# EAGLE design axm1 (EAGLE 5.07)
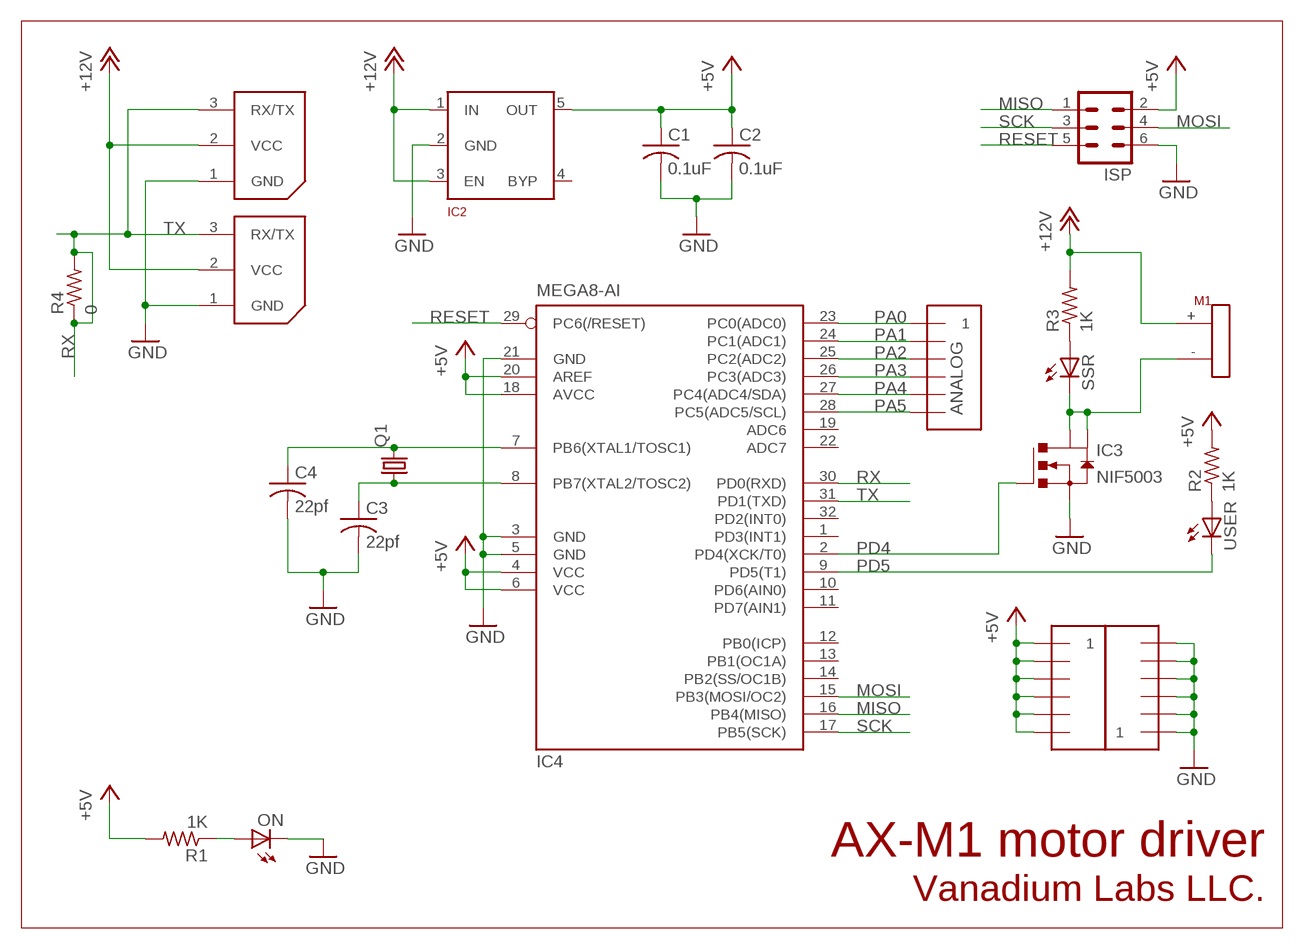
[diagram p0: schematic, sheet 1]

## Parts
C1  0.1uF  C-USC0603  [C0603]
C2  0.1uF  C-USC0603  [C0603]
C3  22pf  C-USC0603  [C0603]
C4  22pf  C-USC0603  [C0603]
IC2  MIC5205-5.0  MIC5205-3.3  [SOT-23-5]
IC3  NIF5003  [SOT223]
IC4  MEGA8-AI  [TQFP32-08]
ISP  MA03-2  [MA03-2]
M1  POWER  [POWER]
ON  LEDCHIPLED_0603  [CHIPLED_0603]
Q1  CRYSTALHC49S  [HC49/S]
R1  1K  R-US_R0603  [R0603]
R2  1K  R-US_R0603  [R0603]
R3  1K  R-US_R0603  [R0603]
R4  0  R-US_R0603  [R0603]
SSR  LEDCHIPLED_0603  [CHIPLED_0603]
U$1  AX-12  [WM18887-ND]
U$2  HEADER6  [1X6]
U$3  HEADER2X6  [2X6]
U$5  AX-12  [WM18887-ND]
USER  LEDCHIPLED_0603  [CHIPLED_0603]

## Nets
+5V: C1.1 C2.1 IC2.5(OUT) IC4.4(VCC) IC4.6(VCC) IC4.18(AVCC) IC4.20(AREF) ISP.2 R1.2 R2.2 U$3.P$7 U$3.P$8 U$3.P$9 U$3.P$10 U$3.P$11 U$3.P$12
+12V: IC2.1(IN) IC2.3(EN) M1.+ R3.2 U$1.2(VCC) U$5.2(VCC)
GND: C1.2 C2.2 C3.2 C4.2 IC2.2(GND) IC3.3(SOURCE) IC4.3(GND) IC4.5(GND) IC4.21(GND) ISP.6 ON.C U$1.1(GND) U$3.P$1 U$3.P$2 U$3.P$3 U$3.P$4 U$3.P$5 U$3.P$6 U$5.1(GND)
MISO: IC4.16(PB4(MISO)) ISP.1
MOSI: IC4.15(PB3(MOSI/OC2)) ISP.4
N$4: IC3.2(DRAIN) IC3.4(DRAIN2) M1.- SSR.C
N$7: R3.1 SSR.A
N$9: C4.1 IC4.7(PB6(XTAL1/TOSC1)) Q1.2
N$10: C3.1 IC4.8(PB7(XTAL2/TOSC2)) Q1.1
N$13: ON.A R1.1
N$14: R2.1 USER.A
PA0: IC4.23(PC0(ADC0)) U$2.P$1
PA1: IC4.24(PC1(ADC1)) U$2.P$2
PA2: IC4.25(PC2(ADC2)) U$2.P$3
PA3: IC4.26(PC3(ADC3)) U$2.P$4
PA4: IC4.27(PC4(ADC4/SDA)) U$2.P$5
PA5: IC4.28(PC5(ADC5/SCL)) U$2.P$6
PD4: IC3.1(GATE) IC4.2(PD4(XCK/T0))
PD5: IC4.9(PD5(T1)) USER.C
RESET: IC4.29(PC6(/RESET)) ISP.5
SCK: IC4.17(PB5(SCK)) ISP.3
TX: IC4.30(PD0(RXD)) IC4.31(PD1(TXD)) R4.1 R4.2 U$1.3(RX/TX) U$5.3(RX/TX)
Unconnected: IC2.4(BYP) IC4.1(PD3(INT1)) IC4.10(PD6(AIN0)) IC4.11(PD7(AIN1)) IC4.12(PB0(ICP)) IC4.13(PB1(OC1A)) IC4.14(PB2(SS/OC1B)) IC4.19(ADC6) IC4.22(ADC7) IC4.32(PD2(INT0))

## Notes on the sheet
- TX
- ANALOG
- RX
- RX
- AX-M1 motor driver
- Vanadium Labs LLC.

## Library data of the parts
C1-C4 = rcl:C-US: CAPACITOR, American symbol
IC2 = robots:MIC5205-3.3
IC3 = robots:NIF5003
IC4 = atmel:MEGA8: MICROCONTROLLER 8 Kbytes FLASH, 1 kbytes SRAM, 512 bytes EEPROM, USART, 6-channel 10 bit ADC, 2-channel 8 bit ADC Pin compatible with Atmega48, ATMega88, ATMega168 Source: avr.lbr
ISP = con-lstb:MA03-2: PIN HEADER
M1 = robots:POWER
ON SSR USER = led:LED: LED OSRAM: - CHIPLED LG R971, LG N971, LY N971, LG Q971, LY Q971, LO R971, LY R971 LH N974, LH R974 LS Q976, LO Q976, LY Q976 LO Q996 - Hyper CHIPLED LW Q18S LB Q993, LB Q99A, LB R99A - SideLED LS A670, LO A670, LY A670, LG A670, LP A670 LB A673, LV A673, LT A673, LW A673 LH A674 LY A675 LS A676, LA A676, LO A676, LY A676, LW A676 LS A679, LY A679, LG A679 - Hyper Micro SIDELED® LS Y876, LA Y876, LO Y876, LY Y876 LT Y87S - SmartLED LW L88C, LW L88S LB L89C, LB L89S, LG L890 LS L89K, LO L89K, LY L89K LS L896, LA L896, LO L896, LY L896 - TOPLED LS T670, LO T670, LY T670, LG T670, LP T670 LSG T670, LSP T670, LSY T670, LOP T670, LYG T670 LG T671, LOG T671, LSG T671 LB T673, LV T673, LT T673, LW T673 LH T674 LS T676, LA T676, LO T676, LY T676, LB T676, LH T676, LSB T676, LW T676 LB T67C, LV T67C, LT T67C, LS T67K, LO T67K, LY T67K, LW E67C LS E67B, LA E67B, LO E67B, LY E67B, LB E67C, LV E67C, LT E67C LW T67C LS T679, LY T679, LG T679 LS T770, LO T770, LY T770, LG T770, LP T770 LB T773, LV T773, LT T773, LW T773 LH T774 LS E675, LA E675, LY E675, LS T675 LS T776, LA T776, LO T776, LY T776, LB T776 LHGB T686 LT T68C, LB T68C - Hyper Mini TOPLED® LB M676 - Mini TOPLED Santana® LG M470 LS M47K, LO M47K, LY M47K Source: http://www.osram.convergy.de LUXEON: - LUMILED® LXK2-PW12-R00, LXK2-PW12-S00, LXK2-PW14-U00, LXK2-PW14-V00 LXK2-PM12-R00, LXK2-PM12-S00, LXK2-PM14-U00 LXK2-PE12-Q00, LXK2-PE12-R00, LXK2-PE12-S00, LXK2-PE14-T00, LXK2-PE14-U00 LXK2-PB12-K00, LXK2-PB12-L00, LXK2-PB12-M00, LXK2-PB14-N00, LXK2-PB14-P00, LXK2-PB14-Q00 LXK2-PR12-L00, LXK2-PR12-M00, LXK2-PR14-Q00, LXK2-PR14-R00 LXK2-PD12-Q00, LXK2-PD12-R00, LXK2-PD12-S00 LXK2-PH12-R00, LXK2-PH12-S00 LXK2-PL12-P00, LXK2-PL12-Q00, LXK2-PL12-R00 Source: www.luxeon.com KINGBRIGHT: KA-3528ASYC Source: www.kingbright.com
Q1 = crystal:CRYSTAL: CRYSTAL
R1-R4 = rcl:R-US_: RESISTOR, American symbol
U$1 U$5 = robots:AX-12
U$2 = robots:HEADER6
U$3 = robots:HEADER2X6

## Board
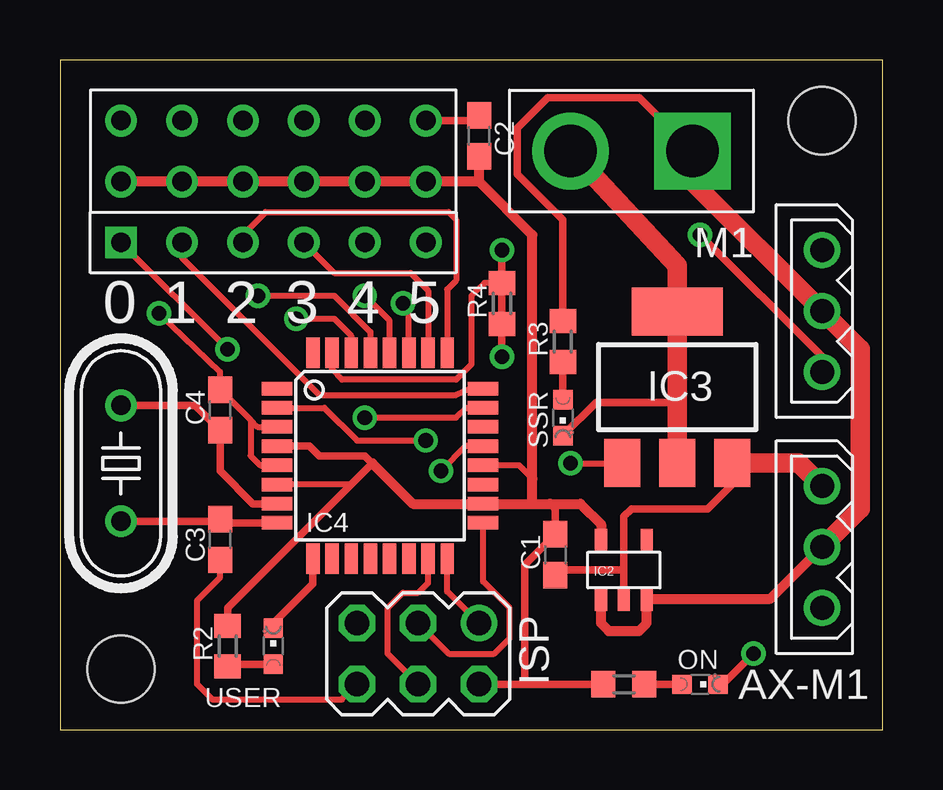
[diagram p1: board, top side]
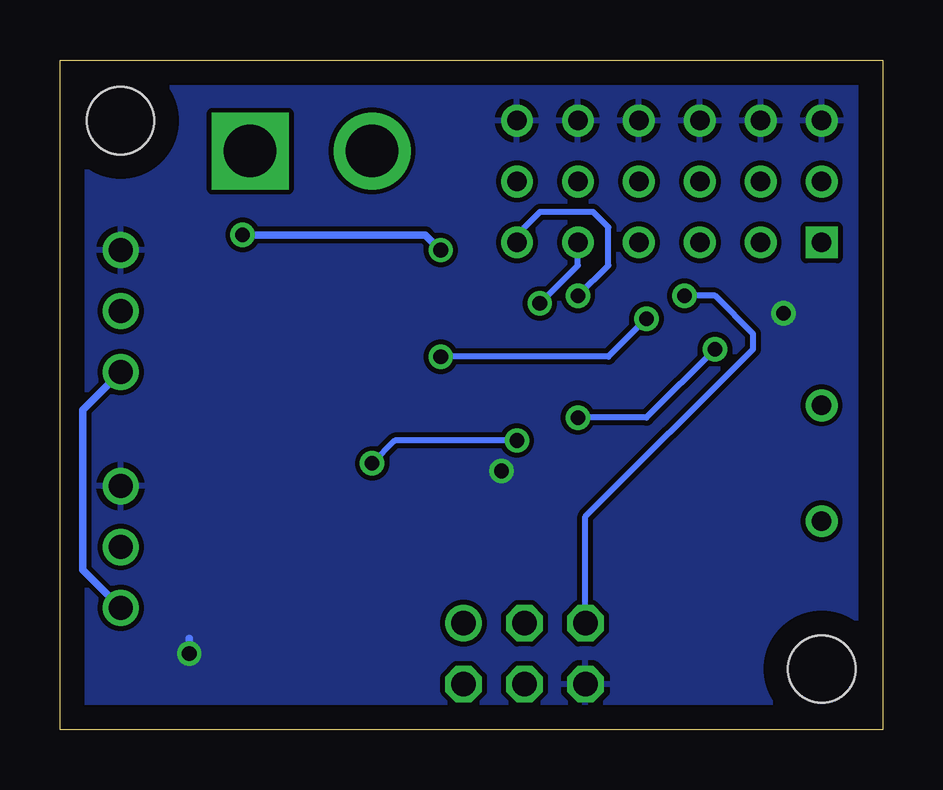
[diagram p2: board, bottom side, seen from below]

Size 34.28 x 27.93 mm. Coordinates in mm from the lower left corner, seen from the top.
Outline: 0,0 34.28,0 34.28,27.93 0,27.93 0,0
Copper layers (1*16): Top 0.035mm / dielectric 1.5mm / Bottom 0.035mm
Design rules "default *": minimum track width 10mil, minimum drill 24mil, track to track 8mil, track to pad 8mil, pad to pad 8mil, via to via 8mil, smd to smd 8mil, copper to edge 40mil, drill to drill 8mil, minimum pad ring 10mil, minimum via ring 8mil, stop-mask expansion 4mil, vias tented up to drill 24mil, thermal gap 10mil
Holes 2.8 mm at 2.54,2.54 31.75,25.4

### Footprints (pad centres in the part's own frame; a part is rotated, then mirrored left to right if it is on the bottom)
C0603 = smd 1.1 x 1: 1 -0.85,0; 2 0.85,0
SOT-23-5 = smd 0.508 x 1.016: 1 -0.95,-1.2; 2 0,-1.2; 3 0.95,-1.2; 4 0.95,1.2; 5 -0.95,1.2
SOT223 = smd 1.5 x 2: 1 -2.3,-3.15; 2 0,-3.15; 3 2.3,-3.15 | smd 3.8 x 2: 4 0,3.15
TQFP32-08 = smd 1.27 x 0.559: 1 -4.293,2.8; 2 -4.293,2; 3 -4.293,1.2; 4 -4.293,0.4; 5 -4.293,-0.4; 6 -4.293,-1.2; 7 -4.293,-2; 8 -4.293,-2.8; 17 4.293,-2.8; 18 4.293,-2; 19 4.293,-1.2; 20 4.293,-0.4; 21 4.293,0.4; 22 4.293,1.2; 23 4.293,2; 24 4.293,2.8 | smd 0.559 x 1.27: 9 -2.8,-4.293; 10 -2,-4.293; 11 -1.2,-4.293; 12 -0.4,-4.293; 13 0.4,-4.293; 14 1.2,-4.293; 15 2,-4.293; 16 2.8,-4.293; 25 2.8,4.293; 26 2,4.293; 27 1.2,4.293; 28 0.4,4.293; 29 -0.4,4.293; 30 -1.2,4.293; 31 -2,4.293; 32 -2.8,4.293
MA03-2 = drill 1.016 round: 1 -2.54,-1.27 | drill 1.016 octagon: 2 -2.54,1.27; 3 0,-1.27; 4 0,1.27; 5 2.54,-1.27; 6 2.54,1.27
POWER = drill 2.184 square: + 0,0 | drill 2.184 round: - 5.08,0
CHIPLED_0603 = smd 0.8 x 0.8: A 0,-0.75; C 0,0.75
HC49/S = drill 0.813 round: 1 -2.413,0; 2 2.413,0
R0603 = smd 1 x 1.1: 1 -0.85,0; 2 0.85,0
WM18887-ND = drill 1 round: 1 0,0; 2 -2.54,0; 3 -5.08,0
1X6 = drill 0.813 square: P$1 0,0 | drill 0.813 round: P$2 2.54,0; P$3 5.08,0; P$4 7.62,0; P$5 10.16,0; P$6 12.7,0
2X6 = drill 0.813 round: P$1 0,0; P$2 2.54,0; P$3 5.08,0; P$4 7.62,0; P$5 10.16,0; P$6 12.7,0; P$7 0,2.54; P$8 2.54,2.54; P$9 5.08,2.54; P$10 7.62,2.54; P$11 10.16,2.54; P$12 12.7,2.54

### Placement (x,y rotation side)
C1  20.64,7.3 270 top
C2  17.46,24.77 90 top
C3  6.67,7.94 270 top
C4  6.67,13.34 90 top
IC2  23.5,6.67 0 top
IC3  25.72,14.29 0 top
IC4  13.34,11.43 0 top
ISP  14.92,3.17 180 top
M1  26.35,24.13 180 top
ON  26.67,1.91 270 top
Q1  2.54,11.11 90 top
R1  23.5,1.91 180 top
R2  6.99,3.49 90 top
R3  20.95,16.19 90 top
R4  18.41,17.78 90 top
SSR  20.95,13.02 180 top
U$1  31.75,20 90 top
U$2  2.54,20.32 0 top
U$3  15.24,25.4 180 top
U$5  31.75,10.16 90 top
USER  8.89,3.49 0 top

### Tracks (layer width: path | path; a pad name or v marks a point on that pad's centre or on a via)
+5V
  Top 0.254: IC4.6 12.13,10.23 12.54,10.64 | IC4.20 19.13,11.03 19.68,10.48
  Top 0.305: 19.37,1.91 ISP.2 | R2.2 6.99,5.08 12.54,10.64 13.02,11.11 12.7,11.43 10.79,11.43 10.39,11.83 IC4.4 | 20.41,9.43 20.64,9.21 C1.1 19.37,6.88 19.37,1.91 | 19.37,1.91 R1.2
  Top 0.406: IC2.5 22.55,8.57 21.68,9.43 20.41,9.43 19.68,9.43 | 19.68,9.43 IC4.18 14.7,9.43 13.02,11.11 | U$3.P$12 U$3.P$11 U$3.P$10 U$3.P$9 U$3.P$8 U$3.P$7 17.46,22.86 | 17.46,22.86 19.68,20.64 19.68,10.48 19.68,9.43 | 17.46,22.86 C2.1
+12V
  Top 0.305: M1.+ 24.13,26.35 20.32,26.35 19.05,25.08 19.05,23.18 20.95,21.27 R3.2
  Top 0.406: U$5.2 29.6,5.47 IC2.3 24.45,4.83 24.45,4.45 24.13,4.13 22.86,4.13 22.55,4.44 IC2.1
  Top 0.813: M1.+ 26.35,22.86 U$1.2 33.34,15.88 33.34,9.21 U$5.2
GND  (via drill 0.61)
  Top 0.254: IC4.3 8.22,12.63 7.94,12.91 | v4.13,17.36 6.67,14.92 C4.2 7.94,12.91 | C3.2 6.67,6.35 5.71,5.4 5.71,1.91 6.35,1.27 11.75,1.27 ISP.6 | IC4.5 8.34,11.03 7.94,11.43 7.94,12.91 | IC4.21 16.91,11.83 v15.88,10.79
  Top 0.305: U$3.P$1 17.25,25.4 C2.2 | 23.5,6.67 23.5,8.89 23.81,9.21 26.99,9.21 27.94,10.16 27.94,11.06 IC3.3 | ON.C 27.62,1.91 v28.89,3.17 | 23.5,6.67 IC2.2 | 23.5,6.67 20.85,6.67 C1.2
  Top 0.813: IC3.3 30.77,11.14 U$5.1
  Bottom 0.254: v4.13,17.36 4.45,17.14 | v15.88,10.79 15.56,10.79
  Bottom 0.305: v28.89,3.17 28.89,3.81
  pour Bottom: 0.64,27.3 33.66,27.3 33.66,0.64 0.64,0.64
MISO
  Top 0.254: IC4.16 16.14,5.77 ISP.1
MOSI
  Top 0.254: IC4.15 15.34,6.13 14.92,5.71 14.29,5.71 13.65,5.08 13.65,3.17 ISP.4
N$4
  Top 0.305: 25.72,13.65 22.34,13.65 SSR.C
  Top 0.813: M1.- 25.72,19.37 IC3.4 25.72,13.65 IC3.2
N$7
  Top 0.305: SSR.A R3.1
N$9
  Top 0.305: Q1.2 5.63,13.53 C4.1 6.67,10.79 8.03,9.43 IC4.7
N$10
  Top 0.305: Q1.1 6.58,8.7 C3.1 6.83,8.63 IC4.8
N$13
  Top 0.305: R1.1 ON.A
N$14
  Top 0.305: USER.A 7.08,2.74 R2.1
PA0  (via drill 0.61)
  Top 0.254: IC4.23 16.92,13.43 16.51,13.02 v12.7,13.02 | v6.99,15.88 U$2.P$1
  Bottom 0.254: v12.7,13.02 9.84,13.02 v6.99,15.88
PA1
  Top 0.254: U$2.P$2 5.08,19.68 10.79,13.97 16.51,13.97 17.09,14.23 IC4.24
PA2
  Top 0.254: U$2.P$3 7.62,20.64 8.57,21.59 16.19,21.59 16.51,21.27 16.51,18.73 16.14,18.36 IC4.25
PA3
  Top 0.254: IC4.26 15.34,18.32 14.61,19.05 11.43,19.05 U$2.P$4
PA4  (via drill 0.61)
  Top 0.254: IC4.27 14.54,17.53 v14.29,17.78
  Bottom 0.254: v14.29,17.78 12.7,19.37 U$2.P$5
PA5  (via drill 0.61)
  Top 0.254: IC4.28 13.73,17.06 v12.7,18.1
  Bottom 0.254: U$2.P$6 15.24,20.64 14.29,21.59 12.06,21.59 11.43,20.95 11.43,19.37 v12.7,18.1
PD4  (via drill 0.61)
  Top 0.254: IC4.2 11.02,13.43 12.38,12.06 v15.24,12.06 | v21.27,11.11 23.39,11.11
  Top 0.305: 23.39,11.11 IC3.1
  Bottom 0.254: v15.24,12.06 20.32,12.06 v21.27,11.11
PD5
  Top 0.305: USER.C 8.89,4.45 10.54,6.09 IC4.9
RESET  (via drill 0.61)
  Top 0.254: IC4.29 12.94,16.59 11.43,18.1 v8.26,18.1
  Bottom 0.254: ISP.5 12.38,8.89 5.4,15.88 5.4,16.51 6.99,18.1 v8.26,18.1
SCK
  Top 0.254: IC4.17 17.63,6.18 18.73,5.08 18.73,3.81 18.1,3.17 16.19,3.17 ISP.3
TX  (via drill 0.61)
  Top 0.254: R4.2 17.68,18.63 17.14,18.1 17.14,15.24 16.51,14.61 11.75,14.61 11.34,15.02 IC4.31 | IC4.30 12.13,16.44 11.43,17.14 v9.84,17.14
  Top 0.305: v26.67,20.64 31.75,15.56 U$1.3 | v18.41,20 R4.2 R4.1 v18.41,15.56
  Bottom 0.254: v18.41,15.56 11.43,15.56 v9.84,17.14
  Bottom 0.305: v18.41,20 19.05,20.64 v26.67,20.64 | U$5.3 33.34,6.67 33.34,13.34 U$1.3

### Text on the board
tNames: 0 | 1 | 2 | 3 | 4 | 5 | ON | AX-M1